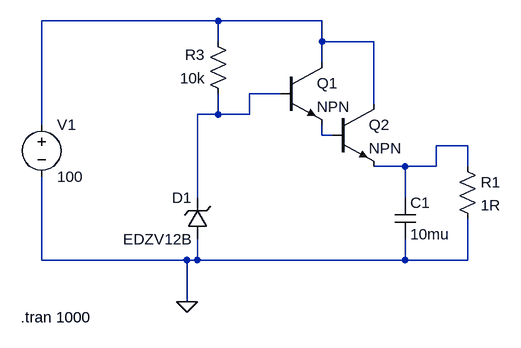
[diagram p0: schematic 12V_npn_only_bipolar.asc]
12V_npn_only_bipolar.asc, the LTspice schematic file:
Version 4
SHEET 1 1168 680
WIRE 416 -144 144 -144
WIRE 576 -144 416 -144
WIRE 416 -112 416 -144
WIRE 576 -112 576 -144
WIRE 656 -112 576 -112
WIRE 576 -80 576 -112
WIRE 512 -32 464 -32
WIRE 656 -16 656 -112
WIRE 416 0 416 -32
WIRE 416 0 384 0
WIRE 464 0 464 -32
WIRE 464 0 416 0
WIRE 144 16 144 -144
WIRE 576 32 576 16
WIRE 592 32 576 32
WIRE 800 48 752 48
WIRE 704 80 656 80
WIRE 752 80 752 48
WIRE 752 80 704 80
WIRE 800 80 800 48
WIRE 384 128 384 0
WIRE 704 128 704 80
WIRE 144 224 144 96
WIRE 368 224 144 224
WIRE 384 224 384 192
WIRE 384 224 368 224
WIRE 704 224 704 192
WIRE 704 224 384 224
WIRE 800 224 800 160
WIRE 800 224 704 224
WIRE 368 288 368 224
FLAG 368 288 0
SYMBOL voltage 144 0 R0
WINDOW 123 0 0 Left 2
WINDOW 39 0 0 Left 2
SYMATTR InstName V1
SYMATTR Value 100
SYMBOL res 432 -16 R180
WINDOW 0 36 76 Left 2
WINDOW 3 36 40 Left 2
SYMATTR InstName R3
SYMATTR Value 10k
SYMBOL zener 400 192 R180
WINDOW 0 24 64 Left 2
WINDOW 3 24 0 Left 2
SYMATTR InstName D1
SYMATTR Value EDZV12B
SYMBOL res 784 64 R0
SYMATTR InstName R1
SYMATTR Value 1R
SYMBOL npn 512 -80 R0
SYMATTR InstName Q1
SYMBOL npn 592 -16 R0
SYMATTR InstName Q2
SYMBOL cap 688 128 R0
SYMATTR InstName C1
SYMATTR Value 10mu
TEXT 112 312 Left 2 !.tran 1000

The netlist it stands for:
* 12V_npn_only_bipolar.asc
V1 N001 0 100
R3 N002 N001 10k
D1 0 N002 EDZV12B
R1 N004 0 1R
Q1 N001 N002 N003 0 NPN
Q2 N001 N003 N004 0 NPN
C1 N004 0 10mu
.model D D
.lib standard.dio
.model NPN NPN
.model PNP PNP
.lib standard.bjt
.tran 1000
.backanno
.end